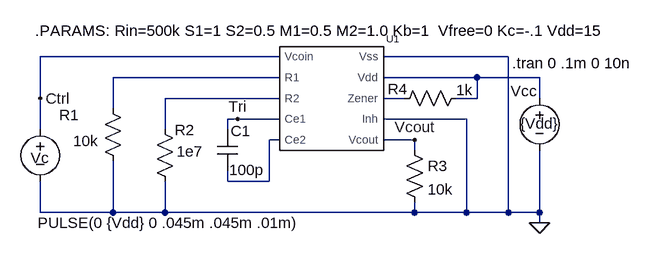
[diagram p0: schematic 4046VcoTest0.asc]
4046VcoTest0.asc, the LTspice schematic file:
Version 4
SHEET 1 880 680
WIRE -320 256 -320 192
WIRE -320 304 -320 256
WIRE -320 432 -320 384
WIRE -208 272 -208 224
WIRE -208 432 -320 432
WIRE -208 432 -208 352
WIRE -128 304 -128 256
WIRE -128 432 -208 432
WIRE -128 432 -128 384
WIRE -32 304 -32 288
WIRE -32 384 -32 368
WIRE -16 288 -32 288
WIRE 32 384 -32 384
WIRE 32 384 32 320
WIRE 48 192 -320 192
WIRE 48 224 -208 224
WIRE 48 256 -128 256
WIRE 48 288 -16 288
WIRE 48 320 32 320
WIRE 240 256 208 256
WIRE 256 320 208 320
WIRE 256 336 256 320
WIRE 256 432 -128 432
WIRE 256 432 256 416
WIRE 336 288 208 288
WIRE 336 432 256 432
WIRE 336 432 336 288
WIRE 352 224 208 224
WIRE 352 256 320 256
WIRE 352 256 352 224
WIRE 400 192 208 192
WIRE 400 432 336 432
WIRE 400 432 400 192
WIRE 448 224 352 224
WIRE 448 256 448 224
WIRE 448 432 400 432
WIRE 448 432 448 336
WIRE 448 448 448 432
FLAG 448 448 0
FLAG 256 320 Vcout
FLAG -320 256 Ctrl
FLAG -16 288 Tri
SYMBOL voltage 448 240 R0
WINDOW 0 -44 5 Left 0
WINDOW 3 -30 55 Left 0
WINDOW 123 0 0 Left 0
WINDOW 39 0 0 Left 0
SYMATTR InstName Vcc
SYMATTR Value {Vdd}
SYMBOL res -224 256 R0
WINDOW 0 -67 26 Left 0
WINDOW 3 -45 66 Left 0
SYMATTR InstName R1
SYMATTR Value 10k
SYMBOL res -144 288 R0
WINDOW 0 31 17 Left 0
WINDOW 3 34 50 Left 0
SYMATTR InstName R2
SYMATTR Value 1e7
SYMBOL res 336 240 R90
WINDOW 0 17 106 VBottom 0
WINDOW 3 -12 3 VTop 0
SYMATTR InstName R4
SYMATTR Value 1k
SYMBOL cap -48 304 R0
WINDOW 3 19 62 Left 0
WINDOW 0 21 2 Left 0
SYMATTR Value 100p
SYMATTR InstName C1
SYMBOL res 240 320 R0
SYMATTR InstName R3
SYMATTR Value 10k
SYMBOL voltage -320 288 R0
WINDOW 0 -15 60 Left 0
WINDOW 3 -4 160 Left 0
WINDOW 123 0 0 Left 0
WINDOW 39 0 0 Left 0
SYMATTR InstName Vc
SYMATTR Value PULSE(0 {Vdd} 0 .045m .045m .01m)
SYMBOL Vco4046 128 256 R0
SYMATTR InstName U1
TEXT 406 202 Left 0 !.tran 0 .1m 0 10n
TEXT -328 152 Left 0 !.PARAMS: Rin=500k S1=1 S2=0.5 M1=0.5 M2=1.0 Kb=1  Vfree=0 Kc=-.1 Vdd=15

The netlist it stands for:
* 4046VcoTest0.asc
Vcc N005 0 {Vdd}
R1 N001 0 10k
R2 N002 0 1e7
R4 N005 N004 1k
C1 Tri N003 100p
R3 Vcout 0 10k
Vc Ctrl 0 PULSE(0 {Vdd} 0 .045m .045m .01m)
XU1 Ctrl N001 N002 Tri N003 Vcout 0 N004 N005 0 Vco4046  ; pins Vcoin R1 R2 Ce1 Ce2 Vcout Inh Zener Vdd Vss
.tran 0 .1m 0 10n
.PARAMS: Rin=500k S1=1 S2=0.5 M1=0.5 M2=1.0 Kb=1  Vfree=0 Kc=-.1 Vdd=15
.backanno
.end